# Altium schematic sheet MIPI_D_CPHY_TX_DUAL.SchDoc
size 420 x 297 mm; SheetNumber: 21; SheetTotal: 23
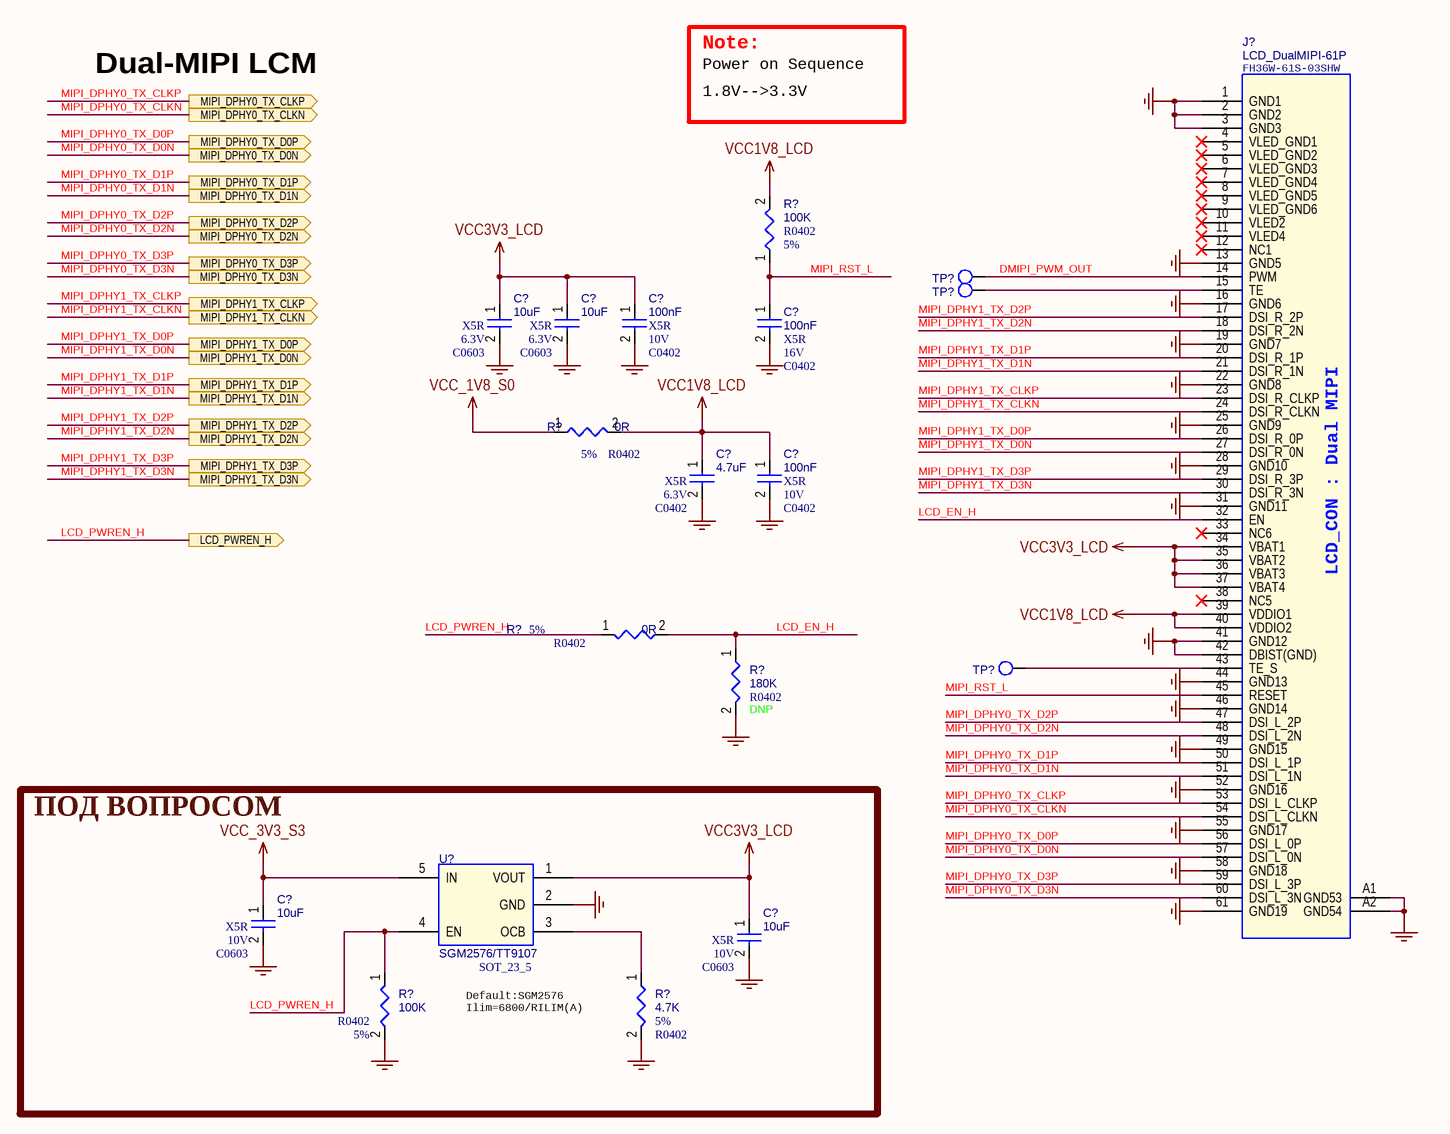
[diagram p0: MIPI_D_CPHY_TX_DUAL.SchDoc]

## Parts
(Parts that share a designator on the sheet are numbered #1, #2 ... from top to bottom, then left to right.)
C?#1  10uF  Dielectric: X5R  Voltage: 6.3V  [C0603]
C?#2  10uF  Dielectric: X5R  Voltage: 6.3V  [C0603]
C?#3  100nF  Dielectric: X5R  Voltage: 10V  [C0402]
C?#4  100nF  Dielectric: X5R  Voltage: 16V  [C0402]
C?#5  4.7uF  Dielectric: X5R  Voltage: 6.3V  [C0402]
C?#6  100nF  Dielectric: X5R  Voltage: 10V  [C0402]
C?#7  10uF  Dielectric: X5R  Voltage: 10V  [C0603]
C?#8  10uF  Dielectric: X5R  Voltage: 10V  [C0603]
J?  LCD_DualMIPI-61P  [FH36W-61S-03SHW]
R?#1  100K  Tolerance: 5%  [R0402]
R?#2  0R  Tolerance: 5%  [R0402]
R?#3  0R  Tolerance: 5%  [R0402]
R?#4  180K  Option: DNP  [R0402]
R?#5  100K  Tolerance: 5%  [R0402]
R?#6  4.7K  Tolerance: 5%  [R0402]
TP?#1  TP_0.7  [TEST]  (value not drawn)
TP?#2  TP_0.7  [TEST]  (value not drawn)
TP?#3  TP_0.7  [TEST]  (value not drawn)
U?  SGM2576/TT9107  [SOT_23_5]

## Blocks framed on the sheet
ПОД ВОПРОСОМ: C?#7 C?#8 R?#5 R?#6 U?

## Ports
LCD_PWREN_H (out, see RK3588_GPIO_MAYBE_IMPORTANT_PINS[4C]), MIPI_DPHY0_TX_CLKN (out, see RK3588_MIPI[2A]), MIPI_DPHY0_TX_CLKP (out, see RK3588_MIPI[2A]), MIPI_DPHY0_TX_D0N (out, see RK3588_MIPI[2A]), MIPI_DPHY0_TX_D0P (out, see RK3588_MIPI[2A]), MIPI_DPHY0_TX_D1N (out, see RK3588_MIPI[2A]), MIPI_DPHY0_TX_D1P (out, see RK3588_MIPI[2A]), MIPI_DPHY0_TX_D2N (out, see RK3588_MIPI[2A]), MIPI_DPHY0_TX_D2P (out, see RK3588_MIPI[2A]), MIPI_DPHY0_TX_D3N (out, see RK3588_MIPI[2A]), MIPI_DPHY0_TX_D3P (out, see RK3588_MIPI[2A]), MIPI_DPHY1_TX_CLKN (out, see RK3588_MIPI[4A]), MIPI_DPHY1_TX_CLKP (out, see RK3588_MIPI[4A]), MIPI_DPHY1_TX_D0N (out, see RK3588_MIPI[4A]), MIPI_DPHY1_TX_D0P (out, see RK3588_MIPI[4A]), MIPI_DPHY1_TX_D1N (out, see RK3588_MIPI[4A]), MIPI_DPHY1_TX_D1P (out, see RK3588_MIPI[4A]), MIPI_DPHY1_TX_D2N (out, see RK3588_MIPI[4A]), MIPI_DPHY1_TX_D2P (out, see RK3588_MIPI[4A]), MIPI_DPHY1_TX_D3N (out, see RK3588_MIPI[4A]), MIPI_DPHY1_TX_D3P (out, see RK3588_MIPI[4A])

## Nets
GND: C?#1.2 C?#2.2 C?#3.2 C?#4.2 C?#5.2 C?#6.2 C?#7.2 C?#8.2 J?.1(GND1) J?.2(GND2) J?.3(GND3) J?.13(GND5) J?.16(GND6) J?.19(GND7) J?.22(GND8) J?.25(GND9) J?.28(GND10) J?.31(GND11) J?.41(GND12) J?.42(DBIST(GND)) J?.44(GND13) J?.46(GND14) J?.49(GND15) J?.52(GND16) J?.55(GND17) J?.58(GND18) J?.61(GND19) J?.A1(GND53) J?.A2(GND54) R?#4.2 R?#5.2 R?#6.2 U?.2(GND)
VCC1V8_LCD: C?#5.1 C?#6.1 J?.39(VDDIO1) J?.40(VDDIO2) R?#1.2 R?#2.2
VCC3V3_LCD: C?#1.1 C?#2.1 C?#3.1 C?#8.1 J?.34(VBAT1) J?.35(VBAT2) J?.36(VBAT3) J?.37(VBAT4) U?.1(VOUT)
VCC_1V8_S0: R?#2.1
VCC_3V3_S3: C?#7.1 U?.5(IN)
DMIPI_PWM_OUT: J?.14(PWM) TP?#1.1
LCD_EN_H: J?.32(EN) R?#3.2 R?#4.1
LCD_PWREN_H: R?#3.1 R?#5.1 U?.4(EN) ; port LCD_PWREN_H
MIPI_DPHY0_TX_CLKN: J?.54(DSI_L_CLKN) ; port MIPI_DPHY0_TX_CLKN
MIPI_DPHY0_TX_CLKP: J?.53(DSI_L_CLKP) ; port MIPI_DPHY0_TX_CLKP
MIPI_DPHY0_TX_D0N: J?.57(DSI_L_0N) ; port MIPI_DPHY0_TX_D0N
MIPI_DPHY0_TX_D0P: J?.56(DSI_L_0P) ; port MIPI_DPHY0_TX_D0P
MIPI_DPHY0_TX_D1N: J?.51(DSI_L_1N) ; port MIPI_DPHY0_TX_D1N
MIPI_DPHY0_TX_D1P: J?.50(DSI_L_1P) ; port MIPI_DPHY0_TX_D1P
MIPI_DPHY0_TX_D2N: J?.48(DSI_L_2N) ; port MIPI_DPHY0_TX_D2N
MIPI_DPHY0_TX_D2P: J?.47(DSI_L_2P) ; port MIPI_DPHY0_TX_D2P
MIPI_DPHY0_TX_D3N: J?.60(DSI_L_3N) ; port MIPI_DPHY0_TX_D3N
MIPI_DPHY0_TX_D3P: J?.59(DSI_L_3P) ; port MIPI_DPHY0_TX_D3P
MIPI_DPHY1_TX_CLKN: J?.24(DSI_R_CLKN) ; port MIPI_DPHY1_TX_CLKN
MIPI_DPHY1_TX_CLKP: J?.23(DSI_R_CLKP) ; port MIPI_DPHY1_TX_CLKP
MIPI_DPHY1_TX_D0N: J?.27(DSI_R_0N) ; port MIPI_DPHY1_TX_D0N
MIPI_DPHY1_TX_D0P: J?.26(DSI_R_0P) ; port MIPI_DPHY1_TX_D0P
MIPI_DPHY1_TX_D1N: J?.21(DSI_R_1N) ; port MIPI_DPHY1_TX_D1N
MIPI_DPHY1_TX_D1P: J?.20(DSI_R_1P) ; port MIPI_DPHY1_TX_D1P
MIPI_DPHY1_TX_D2N: J?.18(DSI_R_2N) ; port MIPI_DPHY1_TX_D2N
MIPI_DPHY1_TX_D2P: J?.17(DSI_R_2P) ; port MIPI_DPHY1_TX_D2P
MIPI_DPHY1_TX_D3N: J?.30(DSI_R_3N) ; port MIPI_DPHY1_TX_D3N
MIPI_DPHY1_TX_D3P: J?.29(DSI_R_3P) ; port MIPI_DPHY1_TX_D3P
MIPI_RST_L: C?#4.1 J?.45(RESET) R?#1.1
NetJ?_15: J?.15(TE) TP?#2.1
NetJ?_43: J?.43(TE_S) TP?#3.1
NetR?#6_1: R?#6.1 U?.3(OCB)

Not connected (* = marked no-connect by the designer): J? 4(VLED_GND1)* 5(VLED_GND2)* 6(VLED_GND3)* 7(VLED_GND4)* 8(VLED_GND5)* 9(VLED_GND6)* 10(VLED2)* 11(VLED4)* 12(NC1)* 33(NC6)* 38(NC5)*

## Notes on the sheet
- Note:
- Dual-MIPI LCM
- Power on Sequence
- 1.8V-->3.3V
- Default:SGM2576
  Ilim=6800/RILIM(A)
- 297x420
- Формат А3
- (in symbol LCD_Dual MIPI-61P_1) LCD_CON : Dual MIPI

## Library data of the parts
C?#1 = CAP NP_Dup1: cap,10.00uF,+/-10%,6.3V,X5R,C0603; Part Reference: C5350; Manufacturer: TDK; RK PN: C1608X5R0J106K080AB; Priority: A; Tolerance: 10%; PCB Footprint: C0603; Value: 10uF; Part Type: C0603; C_Voltage: 6.3V; Manufacturer PN: C1608X5R0J106K080AB; Created by: JJJ
C?#2 = CAP NP_Dup1: cap,10.00uF,+/-10%,6.3V,X5R,C0603; Part Reference: C5351; Manufacturer: TDK; RK PN: C1608X5R0J106K080AB; Priority: A; Tolerance: 10%; PCB Footprint: C0603; Value: 10uF; Part Type: C0603; C_Voltage: 6.3V; Manufacturer PN: C1608X5R0J106K080AB; Created by: JJJ
C?#3 = CAP NP_Dup1: cap,100.00nF,+/-10%,10V,X5R,C0402; Part Reference: C5352; Manufacturer PN: C1005X5R1A104K050BA; Manufacturer: TDK; Tolerance: 10%; Priority: A; PCB Footprint: C0402; Value: 100nF; Created by: JJJ; Part Type: C0402; RK PN: C1005X5R1A104K050BA
C?#4 = CAP NP_Dup1: cap,100.00nF,+/-10%,16V,X5R,C0402; Part Reference: C5340; Manufacturer: TDK; Number: 37; RK PN: C1005X5R1C104K050BA; Priority: A; Tolerance: 10%; C_Voltage: 6.3V; PCB Footprint: C0402; Value: 100nF; Part Type: C0402; Manufacturer PN: C1005X5R1C104K050BA; Created by: JJJ
C?#5 = CAP NP_Dup1: cap,4.70uF,+/-10%,6.3V,X5R,C0402; Part Reference: C5302; Manufacturer PN: C1005X5R0J475K050BC; Manufacturer: TDK; Tolerance: 10%; Priority: A; PCB Footprint: C0402; Value: 4.7uF; Created by: JJJ; C_Voltage: 6.3V; Part Type: C0402; RK PN: C1005X5R0J475K050BC
C?#6 = CAP NP_Dup1: cap,100.00nF,+/-10%,10V,X5R,C0402; Part Reference: C5303; Manufacturer: TDK; RK PN: C1005X5R1A104K050BA; Priority: A; Tolerance: 10%; PCB Footprint: C0402; Value: 100nF; Part Type: C0402; Manufacturer PN: C1005X5R1A104K050BA; Created by: JJJ
C?#7 = CAP NP_Dup1: cap,10.00uF,+/-10%,10V,X5R,C0603; Part Reference: C2333; Manufacturer PN: C1608X5R1A106K080AC; Manufacturer: TDK; Tolerance: 10%; C_Voltage: 6.3V; Priority: A; PCB Footprint: C0603; Value: 10uF; Created by: JJJ; Part Type: C0603; RK PN: C1608X5R1A106K080AC
C?#8 = CAP NP_Dup1: cap,10.00uF,+/-10%,10V,X5R,C0603; Part Reference: C2335; Manufacturer PN: C1608X5R1A106K080AC; Manufacturer: TDK; Tolerance: 10%; C_Voltage: 6.3V; Priority: A; PCB Footprint: C0603; Value: 10uF; Created by: JJJ; Part Type: C0603; RK PN: C1608X5R1A106K080AC
J? = LCD_Dual MIPI-61P_1: Part Reference: J5300; Value: LCD_DualMIPI-61P; PCB Footprint: FH36W-61S-03SHW
R?#1 = RESISTOR_Dup2: НЁУГєсД¤µзЧи,100K,+/-5%,R0402,1/16W.; Part Reference: R5305; Manufacturer PN: RC0402JR-07100KL; Manufacturer: YAGEO; Wattage: 1/16W; Priority: A; PCB Footprint: R0402; Value: 100K; Created by: YTL; Part Type: НЁУГєсД¤µзЧи; RK PN: RC0402JR-07100KL
R?#2 = RESISTOR_Dup2: НЁУГєсД¤µзЧи,0R,+/-5%,R0402,1/16W.; Part Reference: R5301; Manufacturer: YAGEO; RK PN: RC0402JR-070RL; Priority: A; Wattage: 1/16W; PCB Footprint: R0402; Value: 0R; Part Type: НЁУГєсД¤µзЧи; Manufacturer PN: RC0402JR-070RL; Created by: YTL
R?#3 = RESISTOR_Dup2: НЁУГєсД¤µзЧи,0R,+/-5%,R0402,1/16W.; Part Reference: R5302; Manufacturer PN: RC0402JR-070RL; Manufacturer: YAGEO; Wattage: 1/16W; Priority: A; PCB Footprint: R0402; Value: 0R; Created by: YTL; Part Type: НЁУГєсД¤µзЧи; RK PN: RC0402JR-070RL
R?#4 = RESISTOR_Dup2: НЁУГєсД¤µзЧи,180K,+/-5%,R0402,1/16W.; Part Reference: R5303; Manufacturer PN: RC0402JR-07180KL; Manufacturer: YAGEO; Tolerance: 5%; Priority: A; Wattage: 1/16W; PCB Footprint: R0402; Value: 180K; Created by: YTL; Part Type: НЁУГєсД¤µзЧи; RK PN: RC0402JR-07180KL
R?#5 = RESISTOR_Dup2: НЁУГєсД¤µзЧи,100K,+/-5%,R0402,1/16W.; Part Reference: R2324; Manufacturer: YAGEO; RK PN: RC0402JR-07100KL; Priority: A; Wattage: 1/16W; PCB Footprint: R0402; Value: 100K; Part Type: НЁУГєсД¤µзЧи; Manufacturer PN: RC0402JR-07100KL; Created by: YTL
R?#6 = RESISTOR_Dup2: НЁУГєсД¤µзЧи,4K7,+/-5%,R0402,1/16W.; Part Reference: R2323; Manufacturer PN: RC0402JR-074K7L; Manufacturer: YAGEO; Wattage: 1/16W; Priority: A; PCB Footprint: R0402; Value: 4.7K; Created by: YTL; Part Type: НЁУГєсД¤µзЧи; RK PN: RC0402JR-074K7L
TP?#1 = TP: Test Point 0.7mm; Part Reference: TP5300; PCB Footprint: TP_0R70; RK PN: TESTPOINT_0R7; Priority: A; Value: TP_0.7; Part Type: TP; Created by: CZD
TP?#2 = TP: Test Point 0.7mm; Part Reference: TP5301; PCB Footprint: TP_0R70; Priority: A; RK PN: TESTPOINT_0R7; Value: TP_0.7; Created by: CZD; Part Type: TP
TP?#3 = TP: Test Point 0.7mm; Part Reference: TP5302; PCB Footprint: TP_0R70; RK PN: TESTPOINT_0R7; Priority: A; Value: TP_0.7; Part Type: TP; Created by: CZD
U? = SWITCH_SY6280: 1A Current Limited Load Switch; Part Reference: U2306; Manufacturer PN: TT9107; Manufacturer: Torch-chipЈЁМАіПµзЧУЈ©; Priority: A; PCB Footprint: SOT_23_5; Value: SGM2576/TT9107; Created by: JJJ; Part Type: Switch; RK PN: TT9107